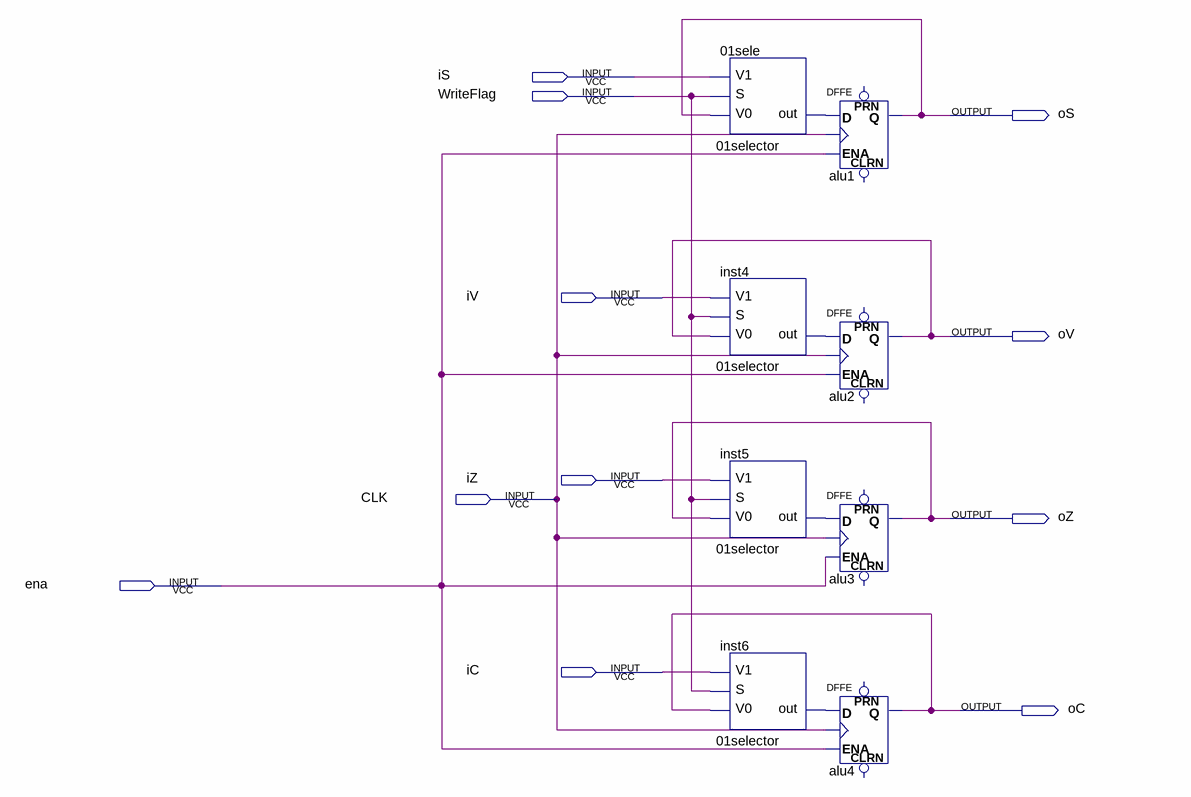
[diagram p0: schematic sheet]
// Quartus schematic SZCVregester.bdf as structural Verilog: 8 symbols, 11 pins
module SZCVregester (
  input  iS,
  input  WriteFlag,
  input  iV,
  input  iZ,
  input  CLK,
  input  ena,
  input  iC,
  output oS,
  output oV,
  output oZ,
  output oC
);

  wire inst4_out, inst5_out, inst6_out, n01sele_out;

  \01selector  u_01sele (.V0(oS), .S(WriteFlag), .V1(iS), .out(n01sele_out));
  \01selector  inst4 (.V0(oV), .S(WriteFlag), .V1(iV), .out(inst4_out));
  \01selector  inst5 (.V0(oZ), .S(WriteFlag), .V1(iZ), .out(inst5_out));
  \01selector  inst6 (.V0(oC), .S(WriteFlag), .V1(iC), .out(inst6_out));
  DFFE alu1 (.D(n01sele_out), .CLK(CLK), .ENA(ena), .Q(oS));  // open: PRN, CLRN
  DFFE alu2 (.D(inst4_out), .CLK(CLK), .ENA(ena), .Q(oV));  // open: PRN, CLRN
  DFFE alu3 (.D(inst5_out), .CLK(CLK), .ENA(ena), .Q(oZ));  // open: PRN, CLRN
  DFFE alu4 (.D(inst6_out), .CLK(CLK), .ENA(ena), .Q(oC));  // open: PRN, CLRN
endmodule
